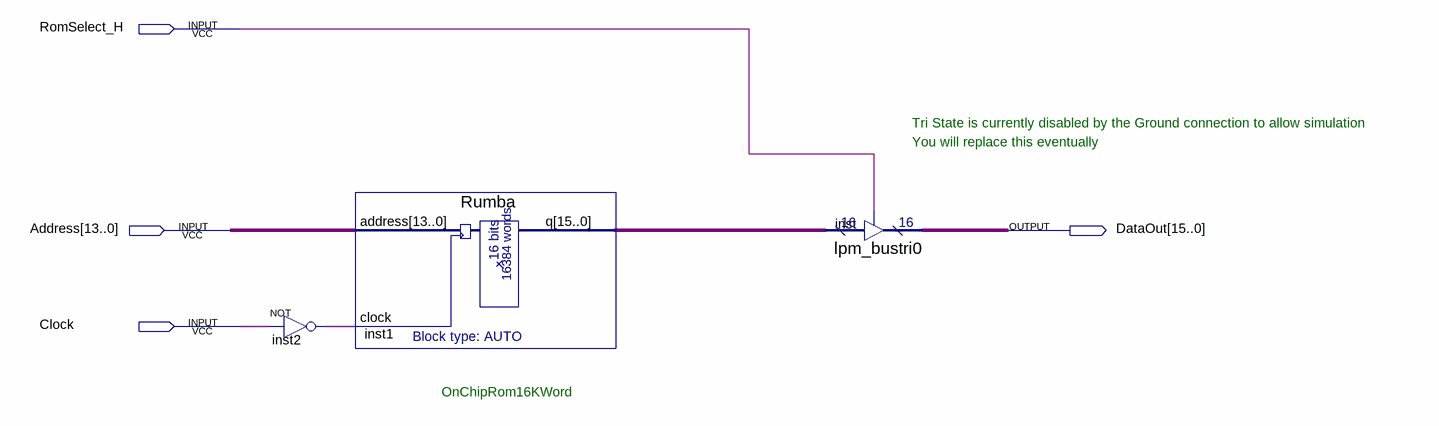
[diagram p0: schematic sheet]
// Quartus schematic OnChipROM16KWords.bdf as structural Verilog: 3 symbols, 4 pins
module OnChipROM16KWords (
  input  RomSelect_H,
  input  [13:0] Address,
  input  Clock,
  output [15:0] DataOut
);

  wire inst2_out;
  wire [15:0] inst1_q;

  not inst2 (inst2_out, Clock);
  Rumba inst1 (.address(Address), .clock(inst2_out), .q(inst1_q));
  lpm_bustri0 inst (.enabledt(RomSelect_H), .data(inst1_q), .tridata(DataOut));

  // Notes on the sheet:
  //   Tri State is currently disabled by the Ground connection to allow simulation
  //   You will replace this eventually
  //   OnChipRom16KWord
endmodule
